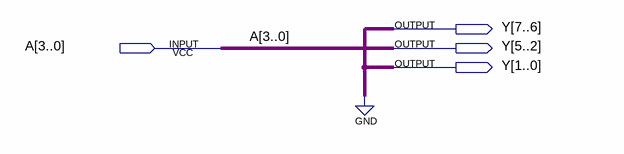
[diagram p0: schematic sheet]
// Quartus schematic Shift2.bdf as structural Verilog: 0 symbols, 4 pins
module Shift2 (
  input  [3:0] A,
  output [7:0] Y
);


  assign Y = {2'b00, A, 2'b00};
endmodule
